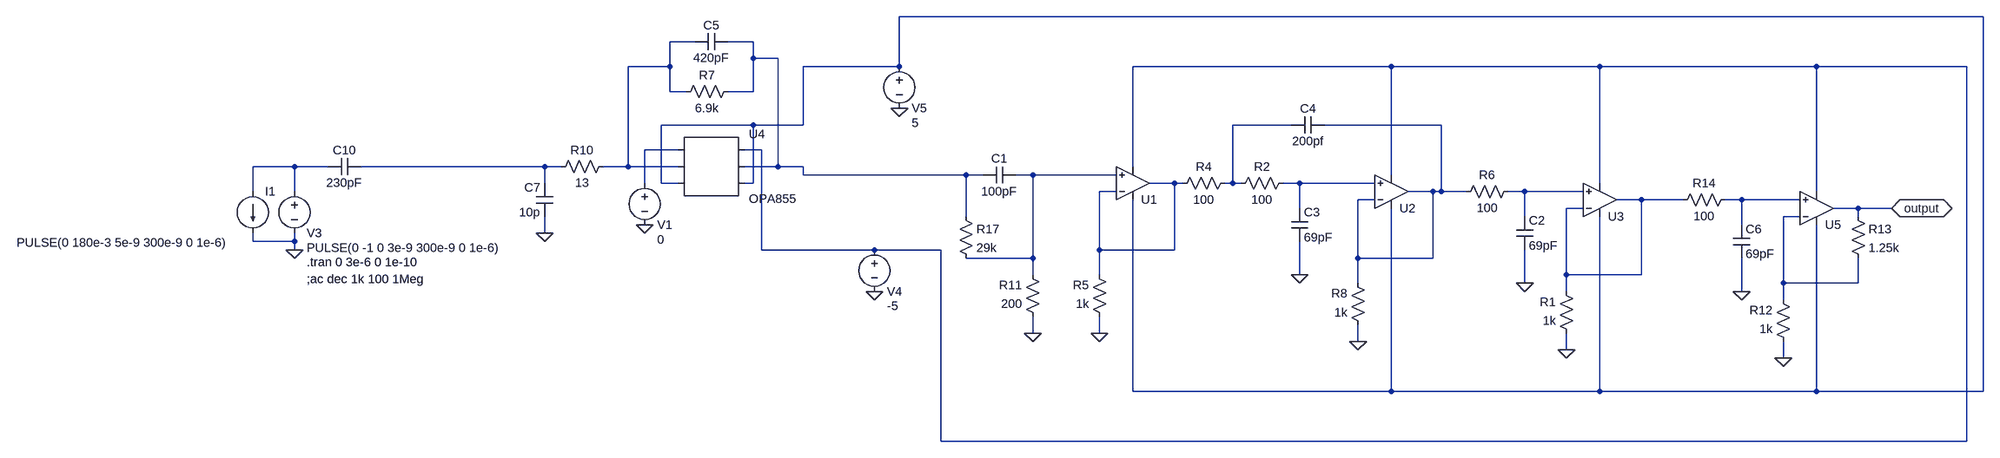
[diagram p0: schematic combined-pulser-CSP-PS - sourced.asc]
combined-pulser-CSP-PS - sourced.asc, the LTspice schematic file:
Version 4
SHEET 1 6580 1524
WIRE 2032 -192 -48 -192
WIRE -464 -144 -512 -144
WIRE -352 -144 -400 -144
WIRE -352 -112 -352 -144
WIRE -304 -112 -352 -112
WIRE -512 -96 -512 -144
WIRE -512 -96 -592 -96
WIRE -48 -96 -48 -192
WIRE -48 -96 -256 -96
WIRE 896 -96 400 -96
WIRE 1296 -96 896 -96
WIRE 1712 -96 1296 -96
WIRE 2000 -96 1712 -96
WIRE -512 -48 -512 -96
WIRE -480 -48 -512 -48
WIRE -352 -48 -352 -112
WIRE -352 -48 -400 -48
WIRE -352 16 -528 16
WIRE -256 16 -256 -96
WIRE -256 16 -352 16
WIRE 704 16 592 16
WIRE 992 16 768 16
WIRE -496 64 -560 64
WIRE -336 64 -368 64
WIRE -1232 96 -1312 96
WIRE -1168 96 -1232 96
WIRE -752 96 -1104 96
WIRE -720 96 -752 96
WIRE -592 96 -592 -96
WIRE -592 96 -640 96
WIRE -496 96 -592 96
WIRE -304 96 -304 -112
WIRE -304 96 -368 96
WIRE -256 96 -304 96
WIRE 400 96 400 -96
WIRE -256 112 -256 96
WIRE 80 112 -256 112
WIRE 112 112 80 112
WIRE 208 112 176 112
WIRE 368 112 208 112
WIRE 896 112 896 -96
WIRE -752 128 -752 96
WIRE -560 128 -560 64
WIRE -528 128 -528 16
WIRE -496 128 -528 128
WIRE -352 128 -352 16
WIRE -352 128 -368 128
WIRE 480 128 432 128
WIRE 496 128 480 128
WIRE 592 128 592 16
WIRE 592 128 576 128
WIRE 608 128 592 128
WIRE 720 128 688 128
WIRE 864 128 720 128
WIRE 1296 128 1296 -96
WIRE -1312 144 -1312 96
WIRE -1232 144 -1232 96
WIRE 368 144 336 144
WIRE 976 144 928 144
WIRE 992 144 992 16
WIRE 992 144 976 144
WIRE 1040 144 992 144
WIRE 1152 144 1120 144
WIRE 1264 144 1152 144
WIRE 1712 144 1712 -96
WIRE 864 160 832 160
WIRE 1376 160 1328 160
WIRE 1456 160 1376 160
WIRE 1568 160 1536 160
WIRE 1680 160 1568 160
WIRE 720 176 720 128
WIRE 1264 176 1232 176
WIRE 1792 176 1744 176
WIRE 1856 176 1792 176
WIRE 80 192 80 112
WIRE 1152 192 1152 144
WIRE 1680 192 1648 192
WIRE 1792 192 1792 176
WIRE 1568 208 1568 160
WIRE -752 224 -752 192
WIRE -1312 240 -1312 224
WIRE -1232 240 -1232 224
WIRE -1232 240 -1312 240
WIRE -1232 256 -1232 240
WIRE -336 256 -336 64
WIRE -96 256 -336 256
WIRE 32 256 -96 256
WIRE 336 256 336 144
WIRE 480 256 480 128
WIRE 480 256 336 256
WIRE 208 272 208 112
WIRE 208 272 80 272
WIRE 832 272 832 160
WIRE 976 272 976 144
WIRE 976 272 832 272
WIRE 208 304 208 272
WIRE 336 304 336 256
WIRE 720 304 720 240
WIRE 1232 304 1232 176
WIRE 1376 304 1376 160
WIRE 1376 304 1232 304
WIRE 832 320 832 272
WIRE 1152 320 1152 256
WIRE 1648 320 1648 192
WIRE 1792 320 1792 272
WIRE 1792 320 1648 320
WIRE 1232 336 1232 304
WIRE 1568 336 1568 272
WIRE 1648 352 1648 320
WIRE 208 416 208 384
WIRE 336 416 336 384
WIRE 832 432 832 400
WIRE 1232 448 1232 416
WIRE 1648 464 1648 432
WIRE 400 528 400 160
WIRE 896 528 896 176
WIRE 896 528 400 528
WIRE 1296 528 1296 192
WIRE 1296 528 896 528
WIRE 1712 528 1712 208
WIRE 1712 528 1296 528
WIRE 2032 528 2032 -192
WIRE 2032 528 1712 528
WIRE 32 624 32 256
WIRE 2000 624 2000 -96
WIRE 2000 624 32 624
FLAG 1856 176 output
IOPIN 1856 176 BiDir
FLAG 208 416 0
FLAG 336 416 0
FLAG 832 432 0
FLAG 1232 448 0
FLAG 720 304 0
FLAG 1152 320 0
FLAG 1648 464 0
FLAG 1568 336 0
FLAG -752 224 0
FLAG -1232 256 0
FLAG -96 336 0
FLAG -560 208 0
FLAG -48 -16 0
SYMBOL res 224 400 R180
WINDOW 0 36 76 Left 2
WINDOW 3 36 40 Left 2
SYMATTR InstName R11
SYMATTR Value 200
SYMBOL res 352 400 R180
WINDOW 0 36 76 Left 2
WINDOW 3 36 40 Left 2
SYMATTR InstName R5
SYMATTR Value 1k
SYMBOL cap 176 96 R90
WINDOW 0 0 32 VBottom 2
WINDOW 3 32 32 VTop 2
SYMATTR InstName C1
SYMATTR Value 100pF
SYMBOL res 592 112 R90
WINDOW 0 0 56 VBottom 2
WINDOW 3 32 56 VTop 2
SYMATTR InstName R4
SYMATTR Value 100
SYMBOL res 848 416 R180
WINDOW 0 36 76 Left 2
WINDOW 3 36 40 Left 2
SYMATTR InstName R8
SYMATTR Value 1k
SYMBOL Opamps\\UniversalOpamp2 400 128 M180
SYMATTR InstName U1
SYMATTR Value2 Avol=1Meg GBW=80Meg Slew=200Meg
SYMBOL Opamps\\UniversalOpamp2 896 144 M180
SYMATTR InstName U2
SYMATTR Value2 Avol=1Meg GBW=80Meg Slew=200Meg
SYMBOL res 1248 432 R180
WINDOW 0 36 76 Left 2
WINDOW 3 36 40 Left 2
SYMATTR InstName R1
SYMATTR Value 1k
SYMBOL Opamps\\UniversalOpamp2 1296 160 M180
SYMATTR InstName U3
SYMATTR Value2 Avol=1Meg GBW=80Meg Slew=200Meg
SYMBOL cap 768 0 R90
WINDOW 0 0 32 VBottom 2
WINDOW 3 32 32 VTop 2
SYMATTR InstName C4
SYMATTR Value 200pf
SYMBOL res 704 112 R90
WINDOW 0 0 56 VBottom 2
WINDOW 3 32 56 VTop 2
SYMATTR InstName R2
SYMATTR Value 100
SYMBOL cap 704 176 R0
SYMATTR InstName C3
SYMATTR Value 69pF
SYMBOL cap 1136 192 R0
SYMATTR InstName C2
SYMATTR Value 69pF
SYMBOL res 1136 128 R90
WINDOW 0 0 56 VBottom 2
WINDOW 3 32 56 VTop 2
SYMATTR InstName R6
SYMATTR Value 100
SYMBOL res 1664 448 R180
WINDOW 0 36 76 Left 2
WINDOW 3 36 40 Left 2
SYMATTR InstName R12
SYMATTR Value 1k
SYMBOL res 1776 176 R0
SYMATTR InstName R13
SYMATTR Value 1.25k
SYMBOL Opamps\\UniversalOpamp2 1712 176 M180
SYMATTR InstName U5
SYMATTR Value2 Avol=1Meg GBW=80Meg Slew=200Meg
SYMBOL cap 1552 208 R0
SYMATTR InstName C6
SYMATTR Value 69pF
SYMBOL res 1552 144 R90
WINDOW 0 0 56 VBottom 2
WINDOW 3 32 56 VTop 2
SYMATTR InstName R14
SYMATTR Value 100
SYMBOL res -384 -64 R90
WINDOW 0 0 56 VBottom 2
WINDOW 3 32 56 VTop 2
SYMATTR InstName R7
SYMATTR Value 6.9k
SYMBOL cap -400 -160 R90
WINDOW 0 0 32 VBottom 2
WINDOW 3 32 32 VTop 2
SYMATTR InstName C5
SYMATTR Value 420pF
SYMBOL cap -736 192 R180
WINDOW 0 24 56 Left 2
WINDOW 3 24 8 Left 2
SYMATTR InstName C7
SYMATTR Value 10p
SYMBOL res -624 80 R90
WINDOW 0 0 56 VBottom 2
WINDOW 3 32 56 VTop 2
SYMATTR InstName R10
SYMATTR Value 13
SYMBOL voltage -1232 128 R0
WINDOW 0 24 96 Left 2
WINDOW 3 24 124 Left 2
WINDOW 123 24 152 Left 2
WINDOW 39 24 152 Left 2
SYMATTR InstName V3
SYMATTR Value PULSE(0 -1 0 3e-9 300e-9 0 1e-6)
SYMBOL cap -1104 80 R90
WINDOW 0 0 32 VBottom 2
WINDOW 3 32 32 VTop 2
SYMATTR InstName C10
SYMATTR Value 230pF
SYMBOL res 64 176 R0
SYMATTR InstName R17
SYMATTR Value 29k
SYMBOL voltage -96 240 R0
WINDOW 0 24 96 Left 2
WINDOW 3 24 124 Left 2
WINDOW 123 0 0 Left 2
WINDOW 39 24 152 Left 2
SYMATTR InstName V4
SYMATTR Value -5
SYMBOL voltage -48 -112 R0
WINDOW 0 24 96 Left 2
WINDOW 3 24 124 Left 2
WINDOW 123 0 0 Left 2
WINDOW 39 24 152 Left 2
SYMATTR InstName V5
SYMATTR Value 5
SYMBOL AutoGenerated\\OPA855 -432 96 R0
SYMATTR InstName U4
SYMBOL voltage -560 112 R0
WINDOW 0 24 96 Left 2
WINDOW 3 24 124 Left 2
WINDOW 123 0 0 Left 2
WINDOW 39 24 152 Left 2
SYMATTR InstName V1
SYMATTR Value 0
SYMBOL current -1312 144 R0
WINDOW 3 -453 98 Left 2
WINDOW 123 0 0 Left 0
WINDOW 39 0 0 Left 0
SYMATTR Value PULSE(0 180e-3 5e-9 300e-9 0 1e-6)
SYMATTR InstName I1
TEXT -1208 312 Left 2 !;ac dec 1k 100 1Meg
TEXT -1208 280 Left 2 !.tran 0 3e-6 0 1e-10

The netlist it stands for:
* combined-pulser-CSP-PS - sourced.asc
R11 0 N010 200
R5 0 N011 1k
C1 N010 N003 100pF
R4 N005 N011 100
R8 0 N006 1k
XU1 N010 N011 N001 N004 N011 level.2 Avol=1Meg GBW=80Meg Slew=200Meg ilimit=25m rail=0 Vos=0 phimargin=45 en=0 enk=0 in=0 ink=0 Rin=500Meg  ; pins IN+ IN- V+ V- OUT
XU2 N012 N006 N001 N004 N006 level.2 Avol=1Meg GBW=80Meg Slew=200Meg ilimit=25m rail=0 Vos=0 phimargin=45 en=0 enk=0 in=0 ink=0 Rin=500Meg  ; pins IN+ IN- V+ V- OUT
R1 0 N014 1k
XU3 N013 N014 N001 N004 N014 level.2 Avol=1Meg GBW=80Meg Slew=200Meg ilimit=25m rail=0 Vos=0 phimargin=45 en=0 enk=0 in=0 ink=0 Rin=500Meg  ; pins IN+ IN- V+ V- OUT
C4 N006 N005 200pf
R2 N012 N005 100
C3 N012 0 69pF
C2 N013 0 69pF
R6 N013 N006 100
R12 0 N016 1k
R13 output N016 1.25k
XU5 N015 N016 N001 N004 output level.2 Avol=1Meg GBW=80Meg Slew=200Meg ilimit=25m rail=0 Vos=0 phimargin=45 en=0 enk=0 in=0 ink=0 Rin=500Meg  ; pins IN+ IN- V+ V- OUT
C6 N015 0 69pF
R14 N015 N014 100
R7 N003 N002 6.9k
C5 N003 N002 420pF
C7 0 N009 10p
R10 N002 N009 13
V3 N008 0 PULSE(0 -1 0 3e-9 300e-9 0 1e-6)
C10 N009 N008 230pF
R17 N003 N010 29k
V4 N004 0 -5
V5 N001 0 5
* U4: OPA855 (symbol AutoGenerated\OPA855 not available, pins judged from their places): pin1=N007 pin2=N002 pin3=N001 pin4=N004 pin5=N003 pin6=N001
V1 N007 0 0
I1 N008 0 PULSE(0 180e-3 5e-9 300e-9 0 1e-6)
;ac dec 1k 100 1Meg
.tran 0 3e-6 0 1e-10
.lib UniversalOpamps2.sub
.backanno
.end